# Altium schematic sheet RechazaBanda(BR).SchDoc
size A4
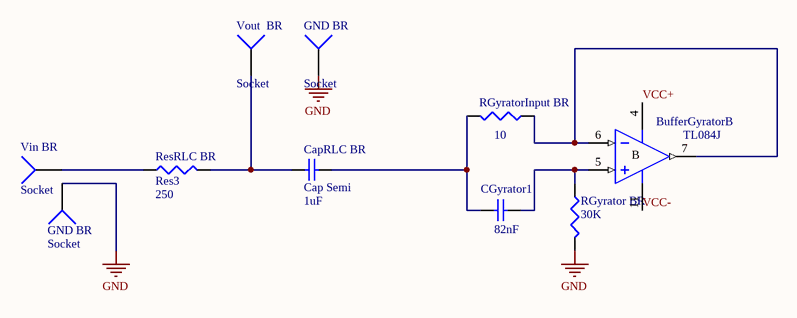
[diagram p0: RechazaBanda(BR).SchDoc]

## Parts
(Parts that share a designator on the sheet are numbered #1, #2 ... from top to bottom, then left to right.)
BufferGyrator  TL084J  [J014]  (part B of 4)
CapRLC_BR  Cap Semi  value 1uF  [C0805]
CGyrator1  value 82nF  [C0805]  (hidden comment: Cap Semi)
GND_BR#1  Socket  [PIN1]
GND_BR#2  Socket  [PIN1]
ResRLC_BR  Res3  value 250  [6-0805_M]
RGyrator_BR  value 30K  [6-0805_M]  (hidden comment: Res3)
RGyratorInput_BR  value 10  [6-0805_M]  (hidden comment: Res3)
Vin_BR  Socket  [PIN1]
Vout_BR  Socket  [PIN1]

## Nets
GND: GND_BR#1.1 GND_BR#2.1 RGyrator_BR.2
VCC+: BufferGyrator.4(V+)
VCC-: BufferGyrator.11(V-)
NetBufferGyrator_5: BufferGyrator.5(IN+) CGyrator1.1 RGyrator_BR.1
NetBufferGyrator_6: BufferGyrator.6(IN-) BufferGyrator.7(OUT) RGyratorInput_BR.1
NetCapRLC_BR_1: CapRLC_BR.1 CGyrator1.2 RGyratorInput_BR.2
NetCapRLC_BR_2: CapRLC_BR.2 ResRLC_BR.2 Vout_BR.1
NetResRLC_BR_1: ResRLC_BR.1 Vin_BR.1

## Notes on the sheet
- (in symbol TL084J, part B) B

## Library data of the parts
BufferGyrator = TL084J: JFET-Input Operational Amplifier; Published: 16-Jan-2001; LatestRevisionDate: 04-Mar-2005; LatestRevisionNote: Stylized 3D Model Added.; DatasheetVersion: Feb-1999; PackageVersion: Jun-1999; PackageReference: J014; Publisher: Altium Limited; PackageDescription: DIP; 14 Leads; Row Spacing 7.62 mm; Pitch 2.54 mm; ComponentLink1Description: Manufacturer Link; ComponentLink1URL: http://www.ti.com/; ComponentLink2Description: Datasheet; ComponentLink2URL: http://www-s.ti.com/sc/ds/tl084.pdf
CapRLC_BR CGyrator1 = Cap Semi: Capacitor (Semiconductor SIM Model); Published: 8-Jun-2000; LatestRevisionDate: 29-May-2009; LatestRevisionNote: IPC-7351 Footprint Added.; PackageReference: C1206; Publisher: Altium Limited; PackageDescription: Chip Capacitor
ResRLC_BR RGyrator_BR RGyratorInput_BR = Res3: Resistor; Published: 8-Jun-2000; LatestRevisionDate: 29-May-2009; LatestRevisionNote: IPC-7351 Footprint Added.; PackageReference: J1-0603; Publisher: Altium Limited; PackageDescription: Chip Resistor
GND_BR#1 GND_BR#2 Vin_BR Vout_BR = Socket: LatestRevisionDate: 17-Jul-2002; LatestRevisionNote: Re-released for DXP Platform.; Publisher: Altium Limited